# Altium schematic sheet [4]_SIM.SchDoc
size B
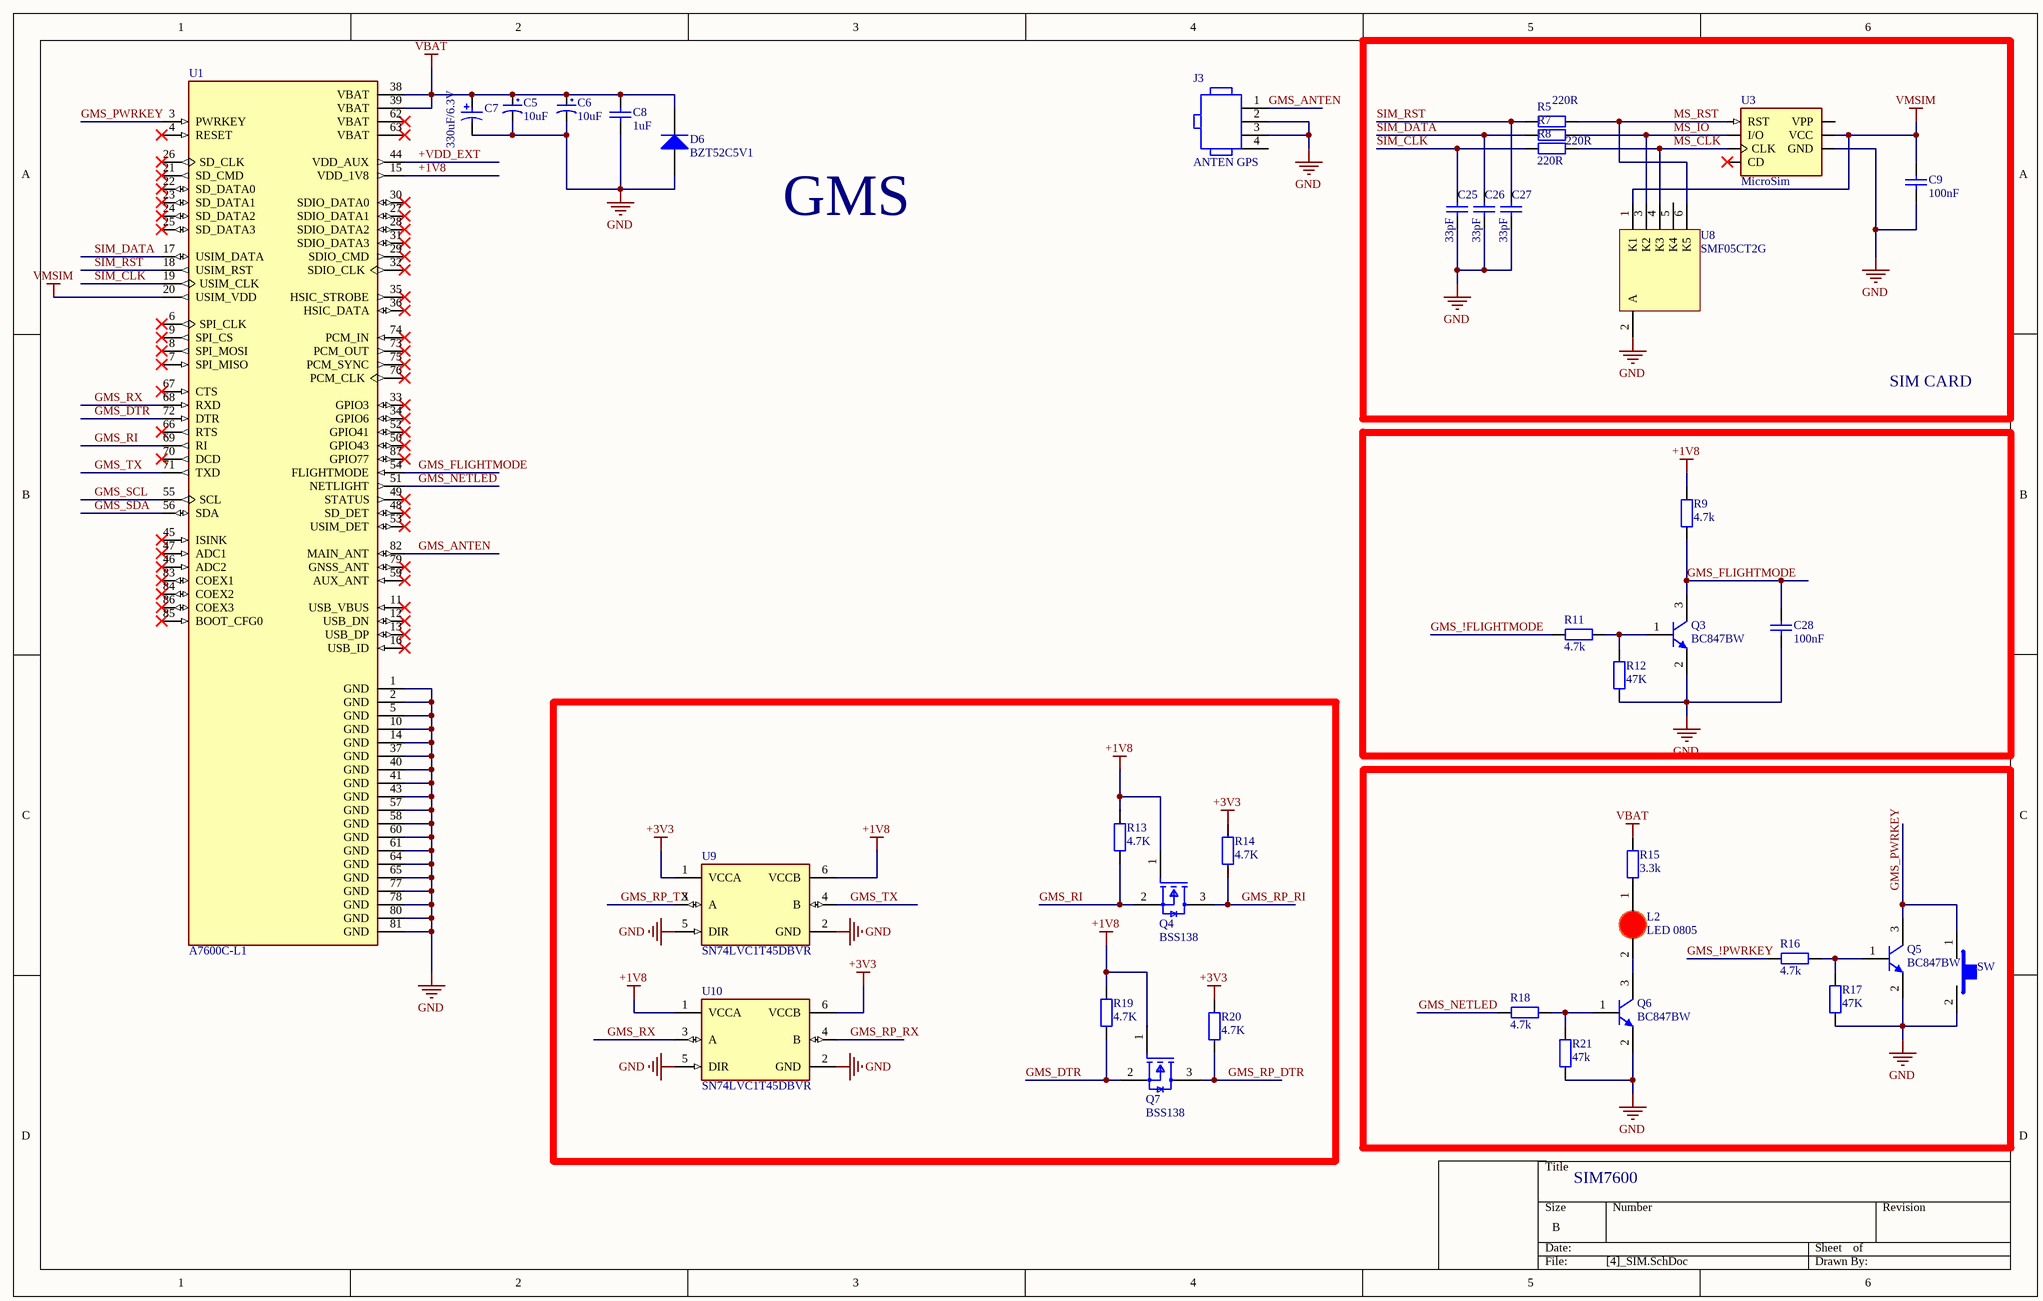
[diagram p0: [4]_SIM.SchDoc]

## Parts
C5  10uF  [tu tantalum smd3528]
C6  10uF  [tu tantalum smd3528]
C7  330uF/6.3V  [NIC-CAPA2-6.3X7.7_V]
C8  1uF  [tu 0603]
C9  100nF  [tu 0603]
C25  33pF  [tu 0603]
C26  33pF  [tu 0603]
C27  33pF  [tu 0603]
C28  100nF  [tu 0603]
D6  BZT52C5V1  [DIODE SOD-123]
J3  ANTEN GPS  [TG-RECE-20369-001E-4_V]
L2  LED 0805  [LED-0805-Red]
Q3  BC847BW  [INF-SOT323_N]
Q4  BSS138  [FP-SOT23-IPC_C]
Q5  BC847BW  [INF-SOT323_N]
Q6  BC847BW  [INF-SOT323_N]
Q7  BSS138  [FP-SOT23-IPC_C]
R5  220R  [tro smd 0603]
R7  220R  [tro smd 0603]
R8  220R  [tro smd 0603]
R9  4.7k  [tro smd 0603]
R11  4.7k  [tro smd 0603]
R12  47K  [tro smd 0603]
R13  4.7K  [tro smd 0603]
R14  4.7K  [tro smd 0603]
R15  3.3k  [tro smd 0603]
R16  4.7k  [tro smd 0603]
R17  47K  [tro smd 0603]
R18  4.7k  [tro smd 0603]
R19  4.7K  [tro smd 0603]
R20  4.7K  [tro smd 0603]
R21  47k  [tro smd 0603]
SW  Tactile  [SW 2P SMD]  (value not drawn)
U1  A7600C-L1  [SIMA7600C]
U3  MicroSim  [Micro-Sim-7P]
U8  SMF05CT2G  [ONSC-SC70-6-419B-02_W_V]
U9  SN74LVC1T45DBVR  [FP-DBV0006A-IPC_B]
U10  SN74LVC1T45DBVR  [FP-DBV0006A-IPC_B]

## Blocks framed on the sheet
SIM CARD: C9 C25-C27 R5 R7 R8 U3 U8

## Nets
+1V8: Q4.1(G) Q7.1(G) R9.2 R13.1 R19.1 U1.15(VDD_1V8) U9.6(VCCB) U10.1(VCCA)
+3V3: R14.2 R20.2 U9.1(VCCA) U10.6(VCCB)
GND: C5.2 C6.2 C7.2 C8.2 C9.2 C25.2 C26.2 C27.2 C28.2 D6.1(A) J3.2 J3.3 Q3.2(E) Q5.2(E) Q6.2(E) R12.1 R17.1 R21.1 SW.2 U1.1(GND) U1.2(GND) U1.5(GND) U1.10(GND) U1.14(GND) U1.37(GND) U1.40(GND) U1.41(GND) U1.43(GND) U1.57(GND) U1.58(GND) U1.60(GND) U1.61(GND) U1.64(GND) U1.65(GND) U1.77(GND) U1.78(GND) U1.80(GND) U1.81(GND) U3.C5(GND) U8.2(A) U9.2(GND) U9.5(DIR) U10.2(GND) U10.5(DIR)
VBAT: C5.1 C6.1 C7.1 C8.1 D6.2(K) R15.2 U1.38(VBAT) U1.39(VBAT)
VMSIM: C9.1 U1.20(USIM_VDD) U3.C1(VCC) U8.1(K1)
+VDD_EXT: U1.44(VDD_AUX)
GMS_!FLIGHTMODE: R11.1
GMS_!PWRKEY: R16.1
GMS_ANTEN: J3.1 U1.82(MAIN_ANT)
GMS_DTR: Q7.2(S) R19.2 U1.72(DTR)
GMS_FLIGHTMODE: C28.1 Q3.3(C) R9.1 U1.54(FLIGHTMODE)
GMS_NETLED: R18.1 U1.51(NETLIGHT)
GMS_PWRKEY: Q5.3(C) SW.1 U1.3(PWRKEY)
GMS_RI: Q4.2(S) R13.2 U1.69(RI)
GMS_RP_DTR: Q7.3(D) R20.1
GMS_RP_RI: Q4.3(D) R14.1
GMS_RP_RX: U10.4(B)
GMS_RP_TX: U9.3(A)
GMS_RX: U1.68(RXD) U10.3(A)
GMS_SCL: U1.55(SCL)
GMS_SDA: U1.56(SDA)
GMS_TX: U1.71(TXD) U9.4(B)
MS_CLK: R8.2 U3.C3(CLK) U8.4(K3)
MS_IO: R7.2 U3.C7(I/O) U8.3(K2)
MS_RST: R5.2 U3.C2(RST) U8.6(K5)
SIM_CLK: C25.1 R8.1 U1.19(USIM_CLK)
SIM_DATA: C26.1 R7.1 U1.17(USIM_DATA)
SIM_RST: C27.1 R5.1 U1.18(USIM_RST)
NetL2_1: L2.1(A) R15.1
NetL2_2: L2.2(K) Q6.3(C)
NetQ3_1: Q3.1(B) R11.2 R12.2
NetQ5_1: Q5.1(B) R16.2 R17.2
NetQ6_1: Q6.1(B) R18.2 R21.2

Not connected (* = marked no-connect by the designer): J3 4; U1 4(RESET)* 6(SPI_CLK)* 7(SPI_MISO)* 8(SPI_MOSI)* 9(SPI_CS)* 11(USB_VBUS)* 12(USB_DN)* 13(USB_DP)* 16(USB_ID)* 21(SD_CMD)* 22(SD_DATA0)* 23(SD_DATA1)* 24(SD_DATA2)* 25(SD_DATA3)* 26(SD_CLK)* 27(SDIO_DATA1)* 28(SDIO_DATA2)* 29(SDIO_CMD)* 30(SDIO_DATA0)* 31(SDIO_DATA3)* 32(SDIO_CLK)* 33(GPIO3)* 34(GPIO6)* 35(HSIC_STROBE)* 36(HSIC_DATA)* 45(ISINK)* 46(ADC2)* 47(ADC1)* 48(SD_DET)* 49(STATUS)* 50(GPIO43)* 52(GPIO41)* 53(USIM_DET)* 59(AUX_ANT)* 62(VBAT)* 63(VBAT)* 66(RTS)* 67(CTS)* 70(DCD)* 73(PCM_OUT)* 74(PCM_IN)* 75(PCM_SYNC)* 76(PCM_CLK)* 79(GNSS_ANT)* 83(COEX1)* 84(COEX2)* 85(BOOT_CFG0)* 86(COEX3)* 87(GPIO77)*; U3 C6(VPP) CD*; U8 5(K4)

## Notes on the sheet
- GMS
- SIM7600

## Library data of the parts
C5 C6 = Tu tantalum 10uF 16V SMD3528: Dán; Don_Vi: Con; So_Chan: 2; Ten_Linh_Kien: Tụ tantalum 106C-10uF 16V SMD3528; Ma_Hang: MH007474; Chung_Loai: Dán; Kieu_Chan: *; ComponentLink1Description: New link; ComponentLink1URL: https://www.thegioiic.com/tu-tantalum-100uf-6-3v-1210-tajb107k006rnj
C7 = CMP-0687-00058-1: Aluminum Electrolytic Capacitor, UD Series, Low Impedance, 330 uF, 6.3 V, + / - 20%, -55 to 105 degC, Chip Type, 6.3 x 7.7 mm D x L, Pb-Free, Reel; PartNumber: UUD0J331MCL1GS; Manufacturer: Nichicon; Impedance: 0.34 Ohm; Rated Ripple Current (at 100kHz): 280 mA; Rated Voltage: 6.3 V; Packing: Dia382mm Reel; Rated Capacitance: 330 uF; Tolerance Rated Capacitance: -20 to 20%; Endurance Time: 2000 h; ComponentLink2Description: Datasheet; ComponentLink3URL: http://products.nichicon.co.jp/en/pdf/XJA043/e-ud.pdf; ComponentLink1Description: Manufacturer URL; Mounting Technology: Surface Mount; ComponentLink2URL: http://products.nichicon.co.jp/en/pdf/XJA043/e-ud.pdf; RoHS: TRUE; Diameter: 6.3 mm; PackageReference: CAPAE-D6.3H7.7; DatasheetVersion: 08/2012; ComponentLink1URL: http://www.nichicon.co.jp/; ComponentLink3Description: Package Specification; Length: 7.7 mm; PackageDescription: 2-Pin Surface Mount Device, Diameter 6.3 mm, Height 7.7 mm, Pitch 5.4 mm; ComponentLink4Description: New link; ComponentLink4URL: https://www.thegioiic.com/tu-nhom-smd-330uf-6-3v-6-3x7-7mm
C8 C25-C27 = Tu 0603 104 50V 10%: Dán; Don_Vi: Con; So_Chan: 2; Ten_Linh_Kien: Tụ 0603 104-100nF 10% 50V; Ma_Hang: MH004568; Chung_Loai: Dán; Kieu_Chan: *
C9 C28 = Tu 0603 105 16V 20%: Dán; Don_Vi: Con; So_Chan: 2; Ten_Linh_Kien: Tụ 0603 105-1uF 20% 16V; Ma_Hang: MH004574; Chung_Loai: Dán; Kieu_Chan: *
D6 = Diode S4: Dán; Ten_Linh_Kien: Diode S4 SOD123 ( 1N5819 SOD123); Ma_Hang: MH005519; Don_Vi: Con; Ghi_Chu: *; Chung_Loai: Dán; Kieu_Chan: *; ComponentLink1Description: New link; ComponentLink1URL: https://www.thegioiic.com/bzt52c5v1-diode-zener-5-1v-500mw
J3 = CMP-0275-00001-2: RF Connector, Onboard Receptacle, IPEX MHFIII; Manufacturer: Taoglas; PartNumber: RECE-20369-001E-01; Packing: Tape and Reel; Mounting Technology: Surface Mount; PackageReference: RECE-20369-001E-01-4; ComponentLink1URL: http://www.taoglas.com/; Housing Color: Gold; DatasheetVersion: Rev. C; ComponentLink2URL: http://www.taoglas.com/images/product_images/original_images/RECE.20369.001E.01.pdf; ComponentLink3Description: Package Specification; PackageVersion: Rev. C; ComponentLink1Description: Manufacturer URL; ComponentLink2Description: Datasheet; PackageDescription: 4-Pin, Hand Drawn, Body 1.7x1.7mm; ComponentLink3URL: http://www.taoglas.com/images/product_images/original_images/RECE.20369.001E.01.pdf
L2 = LED 0805 Do: Dán; Don_Vi: Con; Ma_Hang: MH000897; Ten_Linh_Kien: LED 0805 Màu Đỏ (Red); Ghi_Chu: *; Kieu_Chan: *; Chung_Loai: Dán
Q3 Q5 Q6 = CMP-1177-00080-1: NPN Silicon AF Transistor, 45 V VCEO, 100 mA IC, SOT323, Reel, Green; Manufacturer: Infineon; VCEO (max): 45Â V; ICBO (max): 15Â nA; IBM (max): 200Â mA; Ptot (max): 250Â mW; Green: TRUE; VEBO (max): 6Â V; IC (max): 100Â mA; VCBO (max): 50Â V; fT (typ): 250Â MHz; Halogen-free: TRUE; Packing: Reel; Mounting Technology: Surface Mount; PackageReference: SOT323; PartNumber: BC847BW; PackageDescription: 3-Pin Small Outline Transistor Package, 1.25 x 2 mm Body, 0.65 mm Pitch; ICM (max): 200Â mA; ComponentLink3Description: Package Specification; ComponentLink1URL: http://www.infineon.com/; ComponentLink2Description: Datasheet; Polarity: NPN; ComponentLink2URL: http://www.infineon.com/dgdl/bc847series_bc848series_bc849series_bc850series.pdf?folderId=db3a304314dca389011541d30fa21656&fileId=db3a304314dca389011541d4630a1657; ComponentLink1Description: Manufacturer URL; ComponentLink3URL: http://www.infineon.com/dgdl/SOT323-Package_Overview.pdf?folderId=db3a30431936bc4b0119533e1dcb3c92&fileId=db3a30431936bc4b011953495f283cb1
Q4 Q7 = CMP-12801-000044-2: MOSFET N-CH 50V 500MA SOT23; Turn-On Delay Time: 2.93ns; Max Power Dissipation: 600mW; Drain to Source Resistance: 1.8R; Rise Time: 2.99ns; Turn-Off Delay Time: 9.45ns; Number of Elements: 1; Fall Time: 8.3ns; Gate to Source Voltage (Vgs): 20V; Element Configuration: Single; Input Capacitance: 40pF; Min Operating Temperature: -55°C; Lead Free: Lead Free; Contact Plating: Tin; Number of Pins: 3; Case/Package: SOT-23; Radiation Hardening: No; Drain to Source Voltage (Vdss): 50V; Continuous Drain Current (ID): 500mA; Max Operating Temperature: 150°C; Weight: 0.000282oz; Width: 1.4mm; Length: 3mm; Rds On Max: 1.8R; Height: 1mm; Mount: Surface Mount; Power Dissipation: 600mW; Package Quantity: 3000; Packaging: Tape and Reel; Number of Channels: 1; REACH SVHC: No SVHC
R5 R7 R8 = Tro 0603 5% 220R: Dán; Don_Vi: Con; So_Chan: 2; Ten_Linh_Kien: Trở 0603 5% 220R; Ma_Hang: MH006322; Chung_Loai: Dán; Kieu_Chan: *
R9 R11 R13-R16 R18-R20 = Tro 0603 5% 1k: Dán; Don_Vi: Con; So_Chan: 2; Ten_Linh_Kien: Trở 0603 5% 1k; Ma_Hang: MH006319; Chung_Loai: Dán; Kieu_Chan: *
R12 R17 R21 = Tro 0603 5% 100k: Dán; So_Chan: 2; Ten_Linh_Kien: Trở 0603 5% 100k; Ma_Hang: MH006314; Don_Vi: Con; Chung_Loai: Dán; Kieu_Chan: *
SW = SW_SPDT_2PIN: SMD Mini Push Button Switch 2 Pin 3x6x2.7mm; Manufacturer: OEM; Part number: SPST 2 PIN SMD; Cost: 600; ComponentLink1Description: Link product; ComponentLink1URL: https://www.thegioiic.com/nut-nhan-3-5x6mm-cao-2-5mm-2-chan-smd-dau-trang
U1 = SIMA7600C
U3 = Micro_Sim_7Pin: MS-PP-7P Khay Cắm Micro Sim 7 Chân Push-Push; Manufacturer: Samsung; Part number: C0805; Cost: 200; ComponentLink1Description: Link product; ComponentLink1URL: https://www.thegioiic.com/tu-gom-0805-1-5nf-50v; Package: 0805
U8 = CMP-1061-00157-1: 5-Line Transient Voltage Suppressor Array, 6-Pin SC70, Pb-Free, Tape and Reel; Manufacturer: On Semiconductor; PPK Max (W): 100; IR Max (uA): 5; Direction: Unidirectional; RoHS: Pb-Free; ComponentLink2URL: http://www.onsemi.com/pub_link/Collateral/SMF05C-D.PDF; DatasheetVersion: Rev. 4; PackageVersion: Rev. W; PackageReference: SC70-6-419B-02_W; PartNumber: SMF05CT2G; PackageDescription: 6-Pin Small Outline Transistor, Body 2 x 1.25 mm, Pitch 0.65 mm; Mounting Technology: Surface Mount; ComponentLink3URL: http://www.onsemi.com/pub_link/Collateral/SMF05C-D.PDF; ComponentLink2Description: Datasheet; ComponentLink3Description: Package Specification; Packing: Tape and Reel; ComponentLink1Description: Manufacturer URL; ComponentLink1URL: http://www.onsemi.com/
U9 U10 = CMP-0859-00206-4: IC TRNSLTR BIDIRECTIONAL SOT23-6; Number of Inputs: 1; Logic Function: Translator; Min Supply Voltage: 1.65V; Quiescent Current: 3uA; Turn-On Delay Time: 36.2ns; Max Supply Voltage: 5.5V; Polarity: Non-Inverting; Propagation Delay: 3.9ns; Low Level Output Current: 32mA; Data Rate: 420Mbps; High Level Output Current: -32mA; Number of Bits: 1; Max Operating Temperature: 85°C; Mount: Surface Mount; Lead Free: Lead Free; Number of Elements: 1; Package Quantity: 3000; Number of Pins: 6; Width: 1.3mm; Min Operating Temperature: -40°C; REACH SVHC: No SVHC; Weight: 0.000229oz; Contact Plating: Gold; Height: 1.75mm; Direction: Bidirectional; Number of Channels: 1; Length: 3.05mm; Packaging: Tape and Reel; Radiation Hardening: No; Case/Package: SOT-23